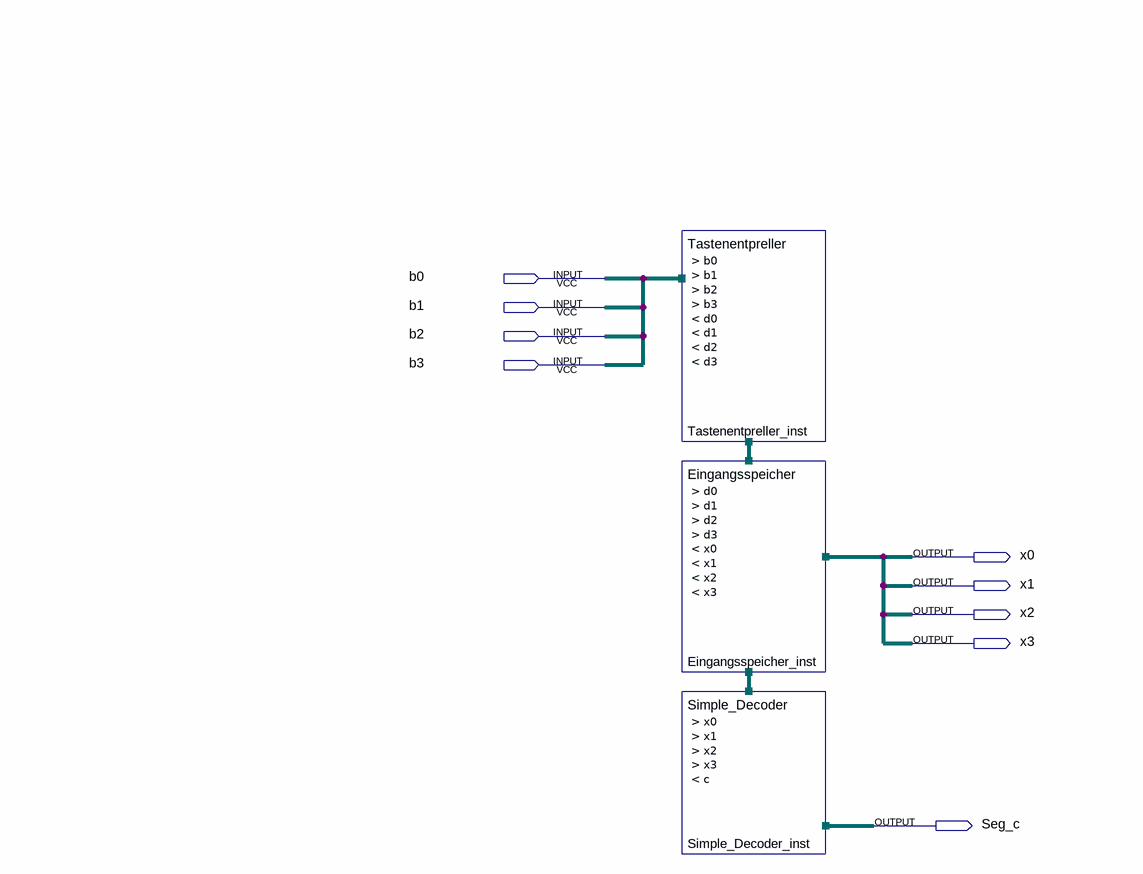
[diagram p0: schematic sheet]
// Quartus schematic Seven_Seg_System.bdf as structural Verilog: 3 symbols, 9 pins
module Seven_Seg_System (
  input  b0,
  input  b1,
  input  b2,
  input  b3,
  output x0,
  output x1,
  output x2,
  output x3,
  output Seg_c
);

  wire d0, d1, d2, d3;

  Tastenentpreller Tastenentpreller_inst (.b0(b0), .b1(b1), .b2(b2), .b3(b3), .d0(d0), .d1(d1), .d2(d2), .d3(d3));
  Eingangsspeicher Eingangsspeicher_inst (.d0(d0), .d1(d1), .d2(d2), .d3(d3), .x0(x0), .x1(x1), .x2(x2), .x3(x3));
  Simple_Decoder Simple_Decoder_inst (.x0(x0), .x1(x1), .x2(x2), .x3(x3), .c(Seg_c));
endmodule
